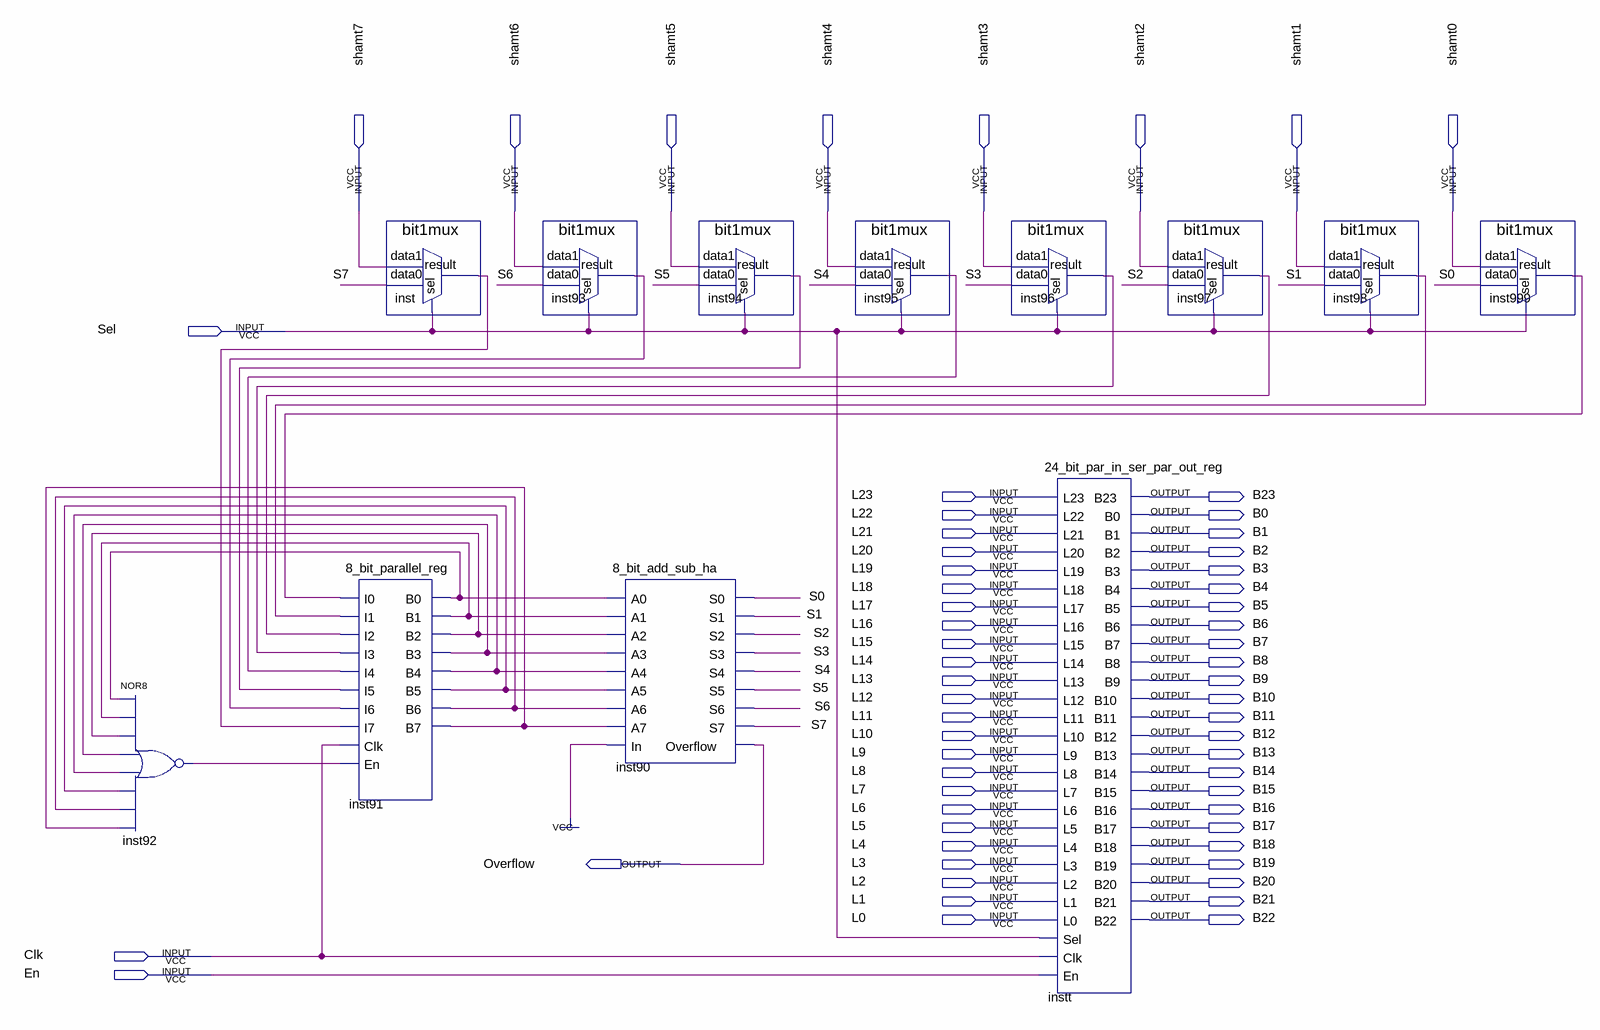
[diagram p0: schematic sheet]
// Quartus schematic variable_shifter.bdf as structural Verilog: 12 symbols, 60 pins
module variable_shifter (
  input  shamt7,
  input  shamt6,
  input  shamt5,
  input  shamt4,
  input  shamt3,
  input  shamt2,
  input  shamt1,
  input  shamt0,
  input  Sel,
  input  L23,
  input  L22,
  input  L21,
  input  L20,
  input  L19,
  input  L18,
  input  L17,
  input  L16,
  input  L15,
  input  L14,
  input  L13,
  input  L12,
  input  L11,
  input  L10,
  input  L9,
  input  L8,
  input  L7,
  input  L6,
  input  L5,
  input  L4,
  input  L3,
  input  L2,
  input  L1,
  input  L0,
  input  Clk,
  input  En,
  output B23,
  output B0,
  output B1,
  output B2,
  output B3,
  output B4,
  output B5,
  output B6,
  output B7,
  output B8,
  output B9,
  output B10,
  output B11,
  output B12,
  output B13,
  output B14,
  output B15,
  output B16,
  output B17,
  output B18,
  output Overflow,
  output B19,
  output B20,
  output B21,
  output B22
);

  wire inst91_b0, inst91_b1, inst91_b2, inst91_b3, inst91_b4, inst91_b5, inst91_b6, inst91_b7, inst92_out,
       inst93_result, inst94_result, inst95_result, inst96_result, inst97_result, inst98_result,
       inst999_result, inst_result, S0, S1, S2, S3, S4, S5, S6, S7;

  nor inst92 (inst92_out, inst91_b0, inst91_b1, inst91_b2, inst91_b3, inst91_b4, inst91_b5, inst91_b6, inst91_b7);
  bit1mux inst (.data1(shamt7), .data0(S7), .sel(Sel), .result(inst_result));
  \8_bit_parallel_reg  inst91 (
    .I0(inst999_result), .I1(inst98_result), .I2(inst97_result), .I3(inst96_result), .I4(inst95_result),
    .I5(inst94_result), .I6(inst93_result), .I7(inst_result), .Clk(Clk), .En(inst92_out), .B0(inst91_b0),
    .B1(inst91_b1), .B2(inst91_b2), .B3(inst91_b3), .B4(inst91_b4), .B5(inst91_b5), .B6(inst91_b6),
    .B7(inst91_b7));
  bit1mux inst93 (.data1(shamt6), .data0(S6), .sel(Sel), .result(inst93_result));
  \8_bit_add_sub_ha  inst90 (
    .A0(inst91_b0), .A1(inst91_b1), .A2(inst91_b2), .A3(inst91_b3), .A4(inst91_b4), .A5(inst91_b5),
    .A6(inst91_b6), .A7(inst91_b7), .In(1'b1), .S0(S0), .S1(S1), .S2(S2), .S3(S3), .S4(S4), .S5(S5), .S6(S6),
    .S7(S7), .Overflow(Overflow));
  bit1mux inst94 (.data1(shamt5), .data0(S5), .sel(Sel), .result(inst94_result));
  bit1mux inst95 (.data1(shamt4), .data0(S4), .sel(Sel), .result(inst95_result));
  bit1mux inst96 (.data1(shamt3), .data0(S3), .sel(Sel), .result(inst96_result));
  \24_bit_par_in_ser_par_out_reg  instt (
    .L23(L23), .L22(L22), .L21(L21), .L20(L20), .L19(L19), .L18(L18), .L17(L17), .L16(L16), .L15(L15),
    .L14(L14), .L13(L13), .L12(L12), .L11(L11), .L10(L10), .L9(L9), .L8(L8), .L7(L7), .L6(L6), .L5(L5),
    .L4(L4), .L3(L3), .L2(L2), .L1(L1), .L0(L0), .Sel(Sel), .Clk(Clk), .En(En), .B23(B23), .B0(B0), .B1(B1),
    .B2(B2), .B3(B3), .B4(B4), .B5(B5), .B6(B6), .B7(B7), .B8(B8), .B9(B9), .B10(B10), .B11(B11), .B12(B12),
    .B13(B13), .B14(B14), .B15(B15), .B16(B16), .B17(B17), .B18(B18), .B19(B19), .B20(B20), .B21(B21),
    .B22(B22));
  bit1mux inst97 (.data1(shamt2), .data0(S2), .sel(Sel), .result(inst97_result));
  bit1mux inst98 (.data1(shamt1), .data0(S1), .sel(Sel), .result(inst98_result));
  bit1mux inst999 (.data1(shamt0), .data0(S0), .sel(Sel), .result(inst999_result));
endmodule
